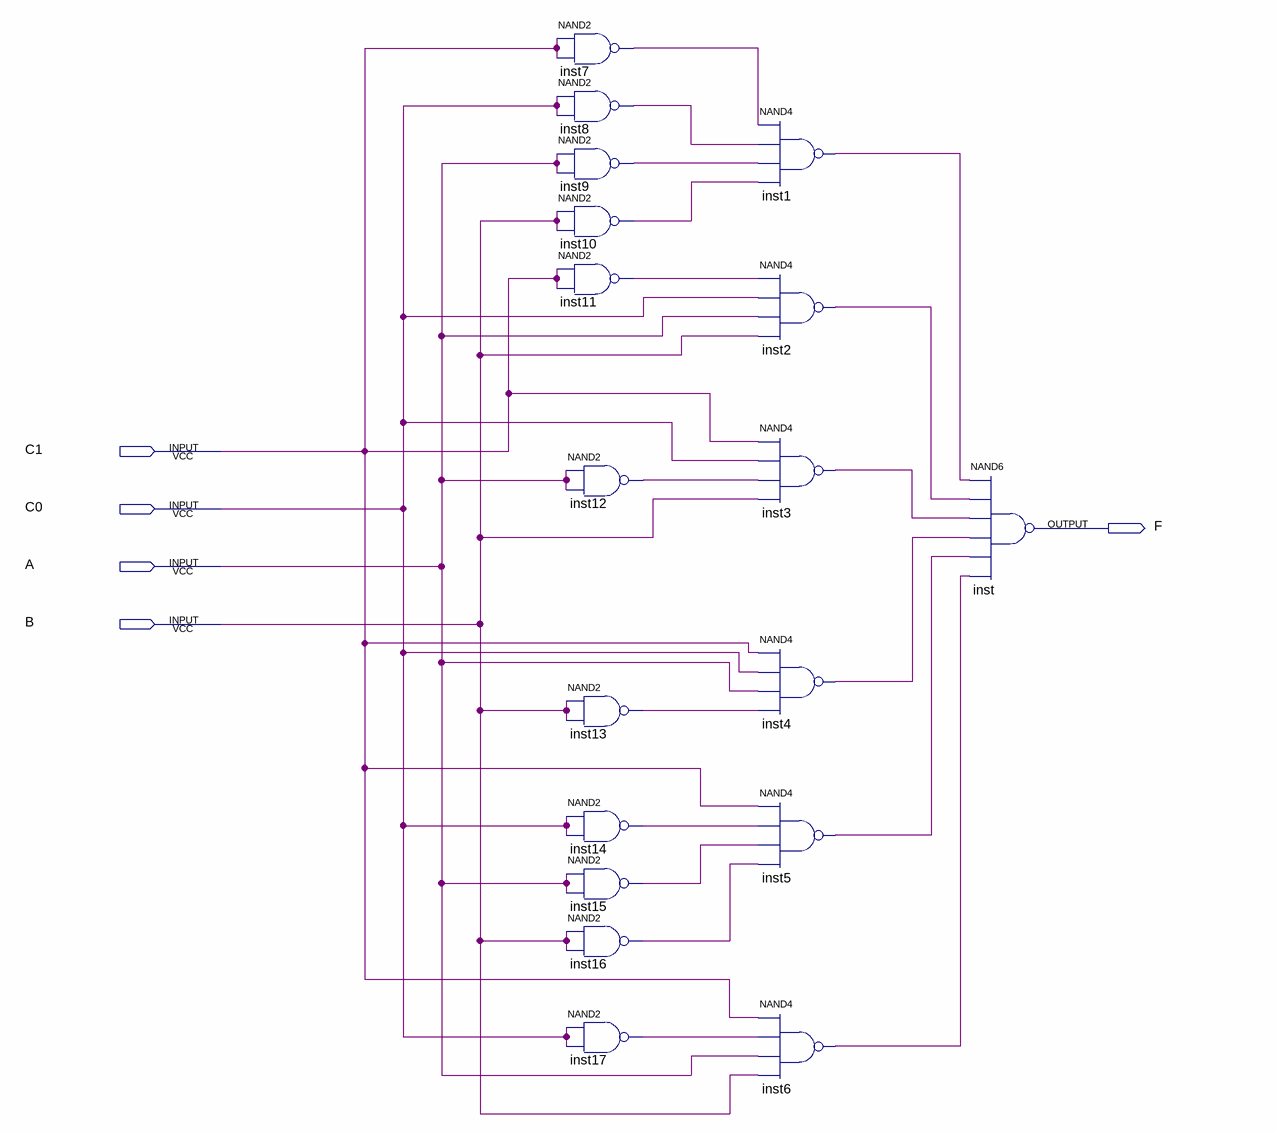
[diagram p0: schematic sheet]
// Quartus schematic PartB.bdf as structural Verilog: 18 symbols, 5 pins
module PartB (
  input  C1,
  input  C0,
  input  A,
  input  B,
  output F
);

  wire inst1_out, inst2_out, inst3_out, inst4_out, inst5_out, inst6_out, inst7_out, inst8_out, inst9_out,
       inst10_out, inst11_out, inst12_out, inst13_out, inst14_out, inst15_out, inst16_out, inst17_out;

  nand inst7 (inst7_out, C1, C1);
  nand inst8 (inst8_out, C0, C0);
  nand inst9 (inst9_out, A, A);
  nand inst10 (inst10_out, B, B);
  nand inst11 (inst11_out, C1, C1);
  nand inst12 (inst12_out, A, A);
  nand inst13 (inst13_out, B, B);
  nand inst14 (inst14_out, C0, C0);
  nand inst15 (inst15_out, A, A);
  nand inst16 (inst16_out, B, B);
  nand inst17 (inst17_out, C0, C0);
  nand inst1 (inst1_out, inst7_out, inst8_out, inst9_out, inst10_out);
  nand inst2 (inst2_out, inst11_out, C0, A, B);
  nand inst3 (inst3_out, C1, C0, inst12_out, B);
  nand inst4 (inst4_out, C1, C0, A, inst13_out);
  nand inst5 (inst5_out, C1, inst14_out, inst15_out, inst16_out);
  nand inst6 (inst6_out, C1, inst17_out, A, B);
  nand inst (F, inst1_out, inst2_out, inst3_out, inst4_out, inst5_out, inst6_out);
endmodule
